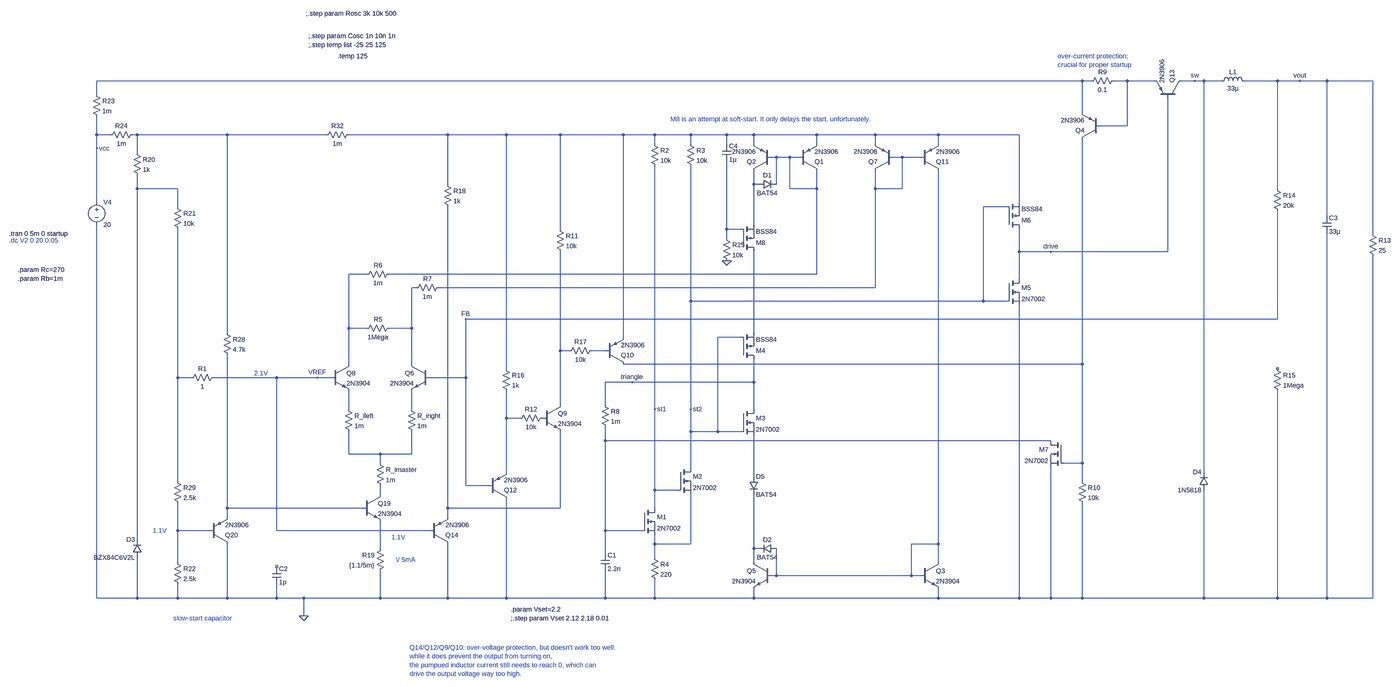
[diagram p0: schematic step_down3.asc, whole sheet]
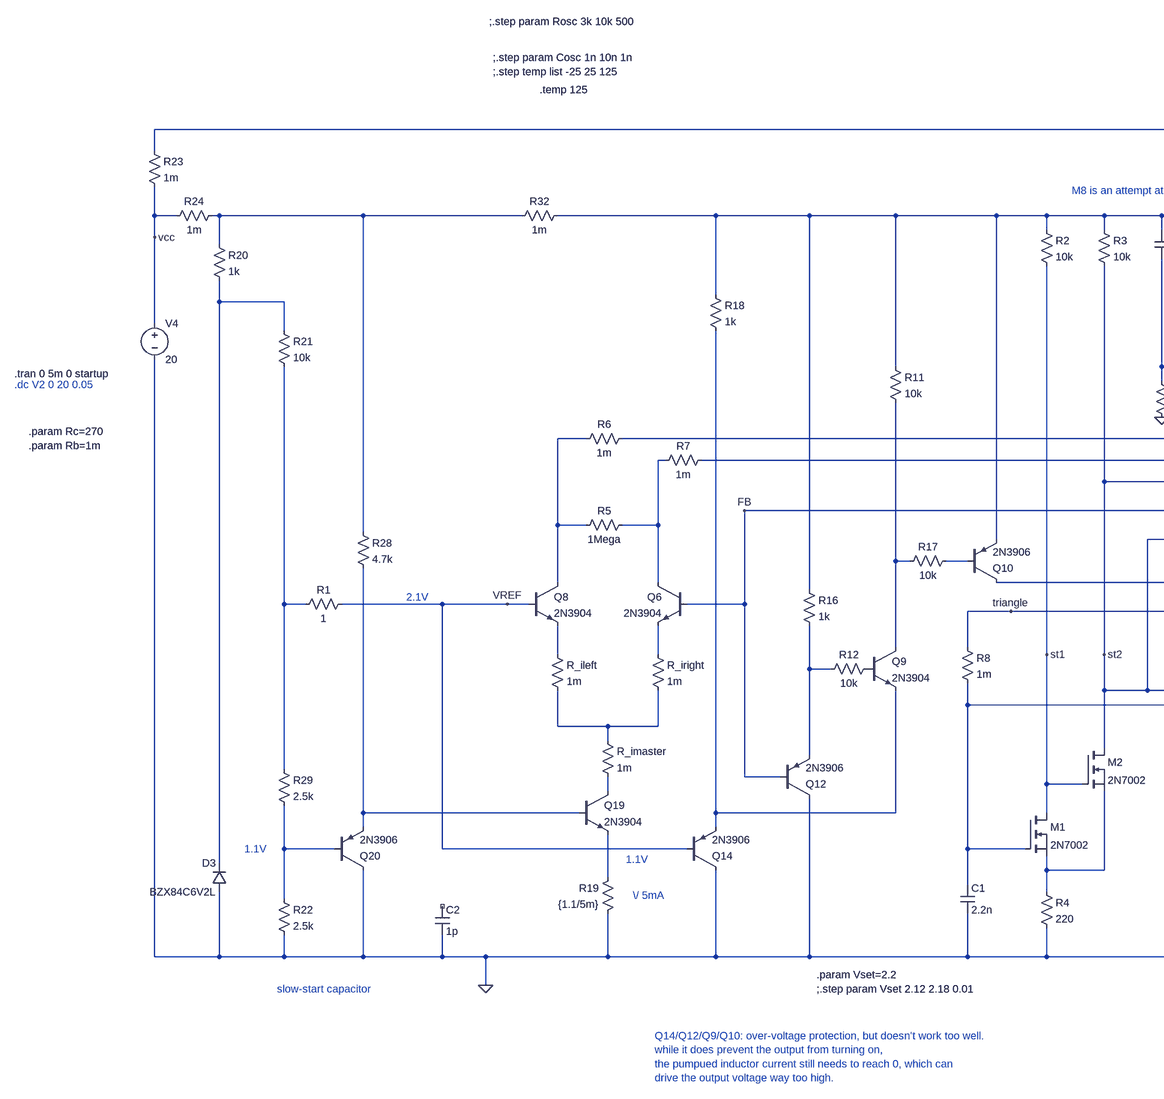
[diagram p1: schematic step_down3.asc, part, row 1 of 1, column 1 of 2]
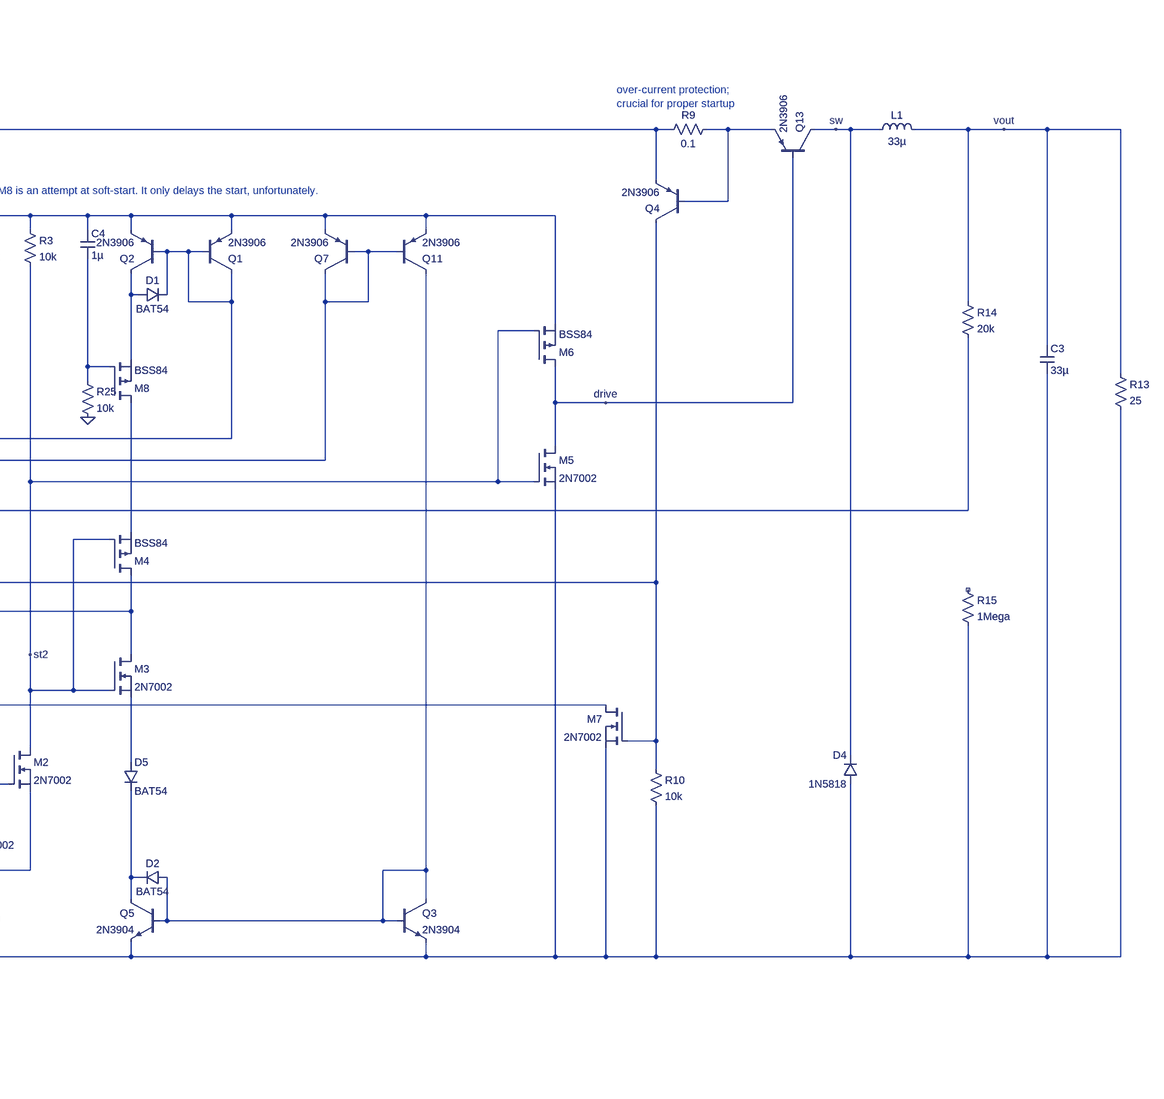
[diagram p2: schematic step_down3.asc, part, row 1 of 1, column 2 of 2]
step_down3.asc, the LTspice schematic file:
Version 4.1
SHEET 1 7684 6532
WIRE 4064 4416 560 4416
WIRE 4096 4416 4064 4416
WIRE 4224 4416 4176 4416
WIRE 4320 4416 4224 4416
WIRE 4464 4416 4416 4416
WIRE 4496 4416 4464 4416
WIRE 4560 4416 4496 4416
WIRE 4816 4416 4640 4416
WIRE 4896 4416 4816 4416
WIRE 4992 4416 4896 4416
WIRE 5184 4416 4992 4416
WIRE 560 4464 560 4416
WIRE 4064 4528 4064 4416
WIRE 4224 4576 4224 4416
WIRE 4224 4576 4128 4576
WIRE 560 4608 560 4544
WIRE 608 4608 560 4608
WIRE 704 4608 688 4608
WIRE 1024 4608 704 4608
WIRE 1376 4608 1024 4608
WIRE 1808 4608 1456 4608
WIRE 2016 4608 1808 4608
WIRE 2208 4608 2016 4608
WIRE 2432 4608 2208 4608
WIRE 2544 4608 2432 4608
WIRE 2672 4608 2544 4608
WIRE 2800 4608 2672 4608
WIRE 2896 4608 2800 4608
WIRE 3120 4608 2896 4608
WIRE 3328 4608 3120 4608
WIRE 3552 4608 3328 4608
WIRE 3840 4608 3552 4608
WIRE 2544 4640 2544 4608
WIRE 2672 4640 2672 4608
WIRE 2800 4640 2800 4608
WIRE 2896 4640 2896 4608
WIRE 3120 4640 3120 4608
WIRE 3328 4640 3328 4608
WIRE 3552 4640 3552 4608
WIRE 560 4656 560 4608
WIRE 704 4672 704 4608
WIRE 2976 4688 2960 4688
WIRE 3024 4688 2976 4688
WIRE 3056 4688 3024 4688
WIRE 3424 4688 3392 4688
WIRE 3488 4688 3424 4688
WIRE 1808 4784 1808 4608
WIRE 2896 4784 2896 4736
WIRE 2912 4784 2896 4784
WIRE 2976 4784 2976 4688
WIRE 704 4800 704 4752
WIRE 848 4800 704 4800
WIRE 3024 4800 3024 4688
WIRE 3120 4800 3120 4736
WIRE 3120 4800 3024 4800
WIRE 3328 4800 3328 4736
WIRE 3424 4800 3424 4688
WIRE 3424 4800 3328 4800
WIRE 4816 4800 4816 4416
WIRE 560 4848 560 4656
WIRE 3840 4848 3840 4608
WIRE 848 4864 848 4800
WIRE 3792 4864 3712 4864
WIRE 4992 4896 4992 4416
WIRE 2896 4928 2896 4784
WIRE 2208 4944 2208 4608
WIRE 2800 4944 2800 4704
WIRE 2848 4944 2800 4944
WIRE 5184 4960 5184 4416
WIRE 2800 4976 2800 4944
WIRE 3840 5024 3840 4944
WIRE 3952 5024 3840 5024
WIRE 4368 5024 4368 4480
WIRE 4368 5024 3952 5024
WIRE 1520 5104 1456 5104
WIRE 3120 5104 3120 4800
WIRE 3120 5104 1600 5104
WIRE 3840 5120 3840 5024
WIRE 1696 5152 1680 5152
WIRE 3328 5152 3328 4800
WIRE 3328 5152 1776 5152
WIRE 2672 5200 2672 4720
WIRE 3712 5200 3712 4864
WIRE 3712 5200 2672 5200
WIRE 3792 5200 3712 5200
WIRE 4816 5264 4816 4880
WIRE 4816 5264 1872 5264
WIRE 1456 5296 1456 5104
WIRE 1520 5296 1456 5296
WIRE 1680 5296 1680 5152
WIRE 1680 5296 1600 5296
WIRE 1024 5312 1024 4608
WIRE 2896 5312 2896 5024
WIRE 2432 5328 2432 4608
WIRE 2848 5328 2768 5328
WIRE 2208 5376 2208 5024
WIRE 2240 5376 2208 5376
WIRE 2368 5376 2320 5376
WIRE 1456 5424 1456 5296
WIRE 1680 5424 1680 5296
WIRE 4064 5424 4064 4624
WIRE 4064 5424 2432 5424
WIRE 2016 5440 2016 4608
WIRE 848 5472 848 4944
WIRE 896 5472 848 5472
WIRE 1200 5472 976 5472
WIRE 1344 5472 1200 5472
WIRE 1392 5472 1344 5472
WIRE 1872 5472 1872 5264
WIRE 1872 5472 1744 5472
WIRE 2464 5488 2368 5488
WIRE 2896 5488 2896 5408
WIRE 2896 5488 2464 5488
WIRE 2208 5568 2208 5376
WIRE 2368 5568 2368 5488
WIRE 1456 5584 1456 5520
WIRE 1680 5584 1680 5520
WIRE 2544 5584 2544 4720
WIRE 2672 5584 2672 5200
WIRE 2896 5584 2896 5488
WIRE 2016 5616 2016 5520
WIRE 2064 5616 2016 5616
WIRE 2672 5664 2672 5584
WIRE 2768 5664 2768 5328
WIRE 2768 5664 2672 5664
WIRE 2848 5664 2768 5664
WIRE 2368 5696 2368 5648
WIRE 3952 5696 2368 5696
WIRE 1456 5744 1456 5664
WIRE 1568 5744 1456 5744
WIRE 1680 5744 1680 5664
WIRE 1680 5744 1568 5744
WIRE 1568 5776 1568 5744
WIRE 4064 5776 4064 5424
WIRE 4064 5776 4000 5776
WIRE 2672 5792 2672 5664
WIRE 2016 5808 2016 5616
WIRE 4496 5808 4496 4416
WIRE 2896 5824 2896 5680
WIRE 848 5840 848 5472
WIRE 4064 5840 4064 5776
WIRE 1872 5856 1872 5472
WIRE 1952 5856 1872 5856
WIRE 2544 5872 2544 5584
WIRE 2624 5872 2544 5872
WIRE 1568 5888 1568 5856
WIRE 1024 5936 1024 5392
WIRE 1504 5936 1024 5936
WIRE 1808 5936 1808 4864
WIRE 2208 5936 2208 5664
WIRE 2208 5936 1808 5936
WIRE 2544 5936 2544 5872
WIRE 1024 5968 1024 5936
WIRE 1808 5968 1808 5936
WIRE 848 6016 848 5920
WIRE 960 6016 848 6016
WIRE 1200 6016 1200 5472
WIRE 1744 6016 1200 6016
WIRE 2368 6016 2368 5696
WIRE 2496 6016 2368 6016
WIRE 704 6048 704 4800
WIRE 2544 6064 2544 6032
WIRE 2672 6064 2672 5888
WIRE 2672 6064 2544 6064
WIRE 3552 6064 3552 4736
WIRE 3552 6064 3456 6064
WIRE 1568 6080 1568 5984
WIRE 2896 6080 2896 5888
WIRE 2912 6080 2896 6080
WIRE 2368 6096 2368 6016
WIRE 2544 6112 2544 6064
WIRE 848 6128 848 6016
WIRE 2896 6128 2896 6080
WIRE 3552 6128 3552 6064
WIRE 2976 6176 2976 6080
WIRE 2976 6176 2960 6176
WIRE 3456 6176 3456 6064
WIRE 3456 6176 2976 6176
WIRE 3488 6176 3456 6176
WIRE 560 6256 560 4928
WIRE 704 6256 704 6112
WIRE 704 6256 560 6256
WIRE 848 6256 848 6208
WIRE 848 6256 704 6256
WIRE 1024 6256 1024 6064
WIRE 1024 6256 848 6256
WIRE 1200 6256 1200 6208
WIRE 1200 6256 1024 6256
WIRE 1296 6256 1200 6256
WIRE 1568 6256 1568 6160
WIRE 1568 6256 1296 6256
WIRE 1808 6256 1808 6064
WIRE 1808 6256 1568 6256
WIRE 2016 6256 2016 5904
WIRE 2016 6256 1808 6256
WIRE 2368 6256 2368 6160
WIRE 2368 6256 2016 6256
WIRE 2544 6256 2544 6192
WIRE 2544 6256 2368 6256
WIRE 2896 6256 2896 6224
WIRE 2896 6256 2544 6256
WIRE 3552 6256 3552 6224
WIRE 3552 6256 2896 6256
WIRE 3840 6256 3840 5216
WIRE 3840 6256 3552 6256
WIRE 3952 6256 3952 5792
WIRE 3952 6256 3840 6256
WIRE 4064 6256 4064 5920
WIRE 4064 6256 3952 6256
WIRE 4496 6256 4496 5872
WIRE 4496 6256 4064 6256
WIRE 4816 6256 4816 5520
WIRE 4816 6256 4496 6256
WIRE 4992 6256 4992 4960
WIRE 4992 6256 4816 6256
WIRE 5184 6256 5184 5040
WIRE 5184 6256 4992 6256
WIRE 1296 6320 1296 6256
FLAG 1296 6320 0
FLAG 1344 5472 VREF
FLAG 1872 5264 FB
FLAG 2464 5488 triangle
FLAG 3952 5024 drive
FLAG 4464 4416 sw
FLAG 2544 5584 st1
FLAG 2672 5584 st2
FLAG 4896 4416 vout
FLAG 560 4656 vcc
FLAG 2800 5056 0
SYMBOL voltage 560 4832 R0
SYMATTR InstName V4
SYMATTR Value 20
SYMBOL res 1584 6064 M0
SYMATTR InstName R19
SYMATTR Value {1.1/5m}
SYMBOL npn 1744 5424 M0
SYMATTR InstName Q6
SYMATTR Value 2N3904
SYMBOL npn 1392 5424 R0
SYMATTR InstName Q8
SYMATTR Value 2N3904
SYMBOL diode 720 6112 R180
WINDOW 0 24 64 Left 2
WINDOW 3 24 0 Left 2
SYMATTR InstName D3
SYMATTR Value BZX84C6V2L
SYMBOL res 688 4656 R0
SYMATTR InstName R20
SYMATTR Value 1k
SYMBOL res 832 4848 R0
SYMATTR InstName R21
SYMATTR Value 10k
SYMBOL res 832 6112 R0
SYMATTR InstName R22
SYMATTR Value 2.5k
SYMBOL res 544 4448 R0
SYMATTR InstName R23
SYMATTR Value 1m
SYMBOL res 592 4624 R270
WINDOW 0 32 56 VTop 2
WINDOW 3 0 56 VBottom 2
SYMATTR InstName R24
SYMATTR Value 1m
SYMBOL res 1552 5760 R0
SYMATTR InstName R_imaster
SYMATTR Value 1m
SYMBOL npn 1504 5888 R0
SYMATTR InstName Q19
SYMATTR Value 2N3904
SYMBOL res 1008 5296 R0
SYMATTR InstName R28
SYMATTR Value 4.7k
SYMBOL pnp 960 6064 M180
SYMATTR InstName Q20
SYMATTR Value 2N3906
SYMBOL res 832 5824 R0
SYMATTR InstName R29
SYMATTR Value 2.5k
SYMBOL res 1360 4624 R270
WINDOW 0 32 56 VTop 2
WINDOW 3 0 56 VBottom 2
SYMATTR InstName R32
SYMATTR Value 1m
SYMBOL pnp 4416 4480 M270
SYMATTR InstName Q13
SYMATTR Value 2N3906
SYMBOL cap 4976 4896 R0
SYMATTR InstName C3
SYMATTR Value 33µ
SYMBOL res 5168 4944 R0
SYMATTR InstName R13
SYMATTR Value 25
SYMBOL res 4800 4784 R0
SYMATTR InstName R14
SYMATTR Value 20k
SYMBOL res 4800 5424 R0
SYMATTR InstName R15
SYMATTR Value 1Mega
SYMBOL ind 4544 4432 R270
WINDOW 0 32 56 VTop 2
WINDOW 3 5 56 VBottom 2
SYMATTR InstName L1
SYMATTR Value 33µ
SYMATTR SpiceLine Rser=1m
SYMBOL nmos 2496 5936 R0
SYMATTR InstName M1
SYMATTR Value 2N7002
SYMBOL nmos 2624 5792 R0
SYMATTR InstName M2
SYMATTR Value 2N7002
SYMBOL res 2528 4624 R0
SYMATTR InstName R2
SYMATTR Value 10k
SYMBOL res 2656 4624 R0
SYMATTR InstName R3
SYMATTR Value 10k
SYMBOL res 2528 6096 R0
SYMATTR InstName R4
SYMATTR Value 220
SYMBOL nmos 2848 5584 R0
SYMATTR InstName M3
SYMATTR Value 2N7002
SYMBOL cap 2352 6096 R0
SYMATTR InstName C1
SYMATTR Value 2.2n
SYMBOL pmos 2848 5408 M180
SYMATTR InstName M4
SYMATTR Value BSS84
SYMBOL pnp 3056 4736 M180
SYMATTR InstName Q1
SYMATTR Value 2N3906
SYMBOL pnp 2960 4736 R180
SYMATTR InstName Q2
SYMATTR Value 2N3906
SYMBOL diode 2912 4800 R270
WINDOW 0 32 32 VTop 2
WINDOW 3 0 32 VBottom 2
SYMATTR InstName D1
SYMATTR Value BAT54
SYMBOL diode 2976 6096 M270
WINDOW 0 32 32 VTop 2
WINDOW 3 0 32 VBottom 2
SYMATTR InstName D2
SYMATTR Value BAT54
SYMBOL npn 3488 6128 R0
SYMATTR InstName Q3
SYMATTR Value 2N3904
SYMBOL npn 2960 6128 M0
SYMATTR InstName Q5
SYMATTR Value 2N3904
SYMBOL pnp 3392 4736 R180
SYMATTR InstName Q7
SYMATTR Value 2N3906
SYMBOL pnp 3488 4736 M180
SYMATTR InstName Q11
SYMATTR Value 2N3906
SYMBOL nmos 3792 5120 R0
SYMATTR InstName M5
SYMATTR Value 2N7002
SYMBOL pmos 3792 4944 M180
SYMATTR InstName M6
SYMATTR Value BSS84
SYMBOL diode 4512 5872 R180
WINDOW 0 24 64 Left 2
WINDOW 3 24 0 Left 2
SYMATTR InstName D4
SYMATTR Value 1N5818
SYMBOL cap 1184 6144 R0
SYMATTR InstName C2
SYMATTR Value 1p
SYMBOL res 1440 5568 R0
SYMATTR InstName R_ileft
SYMATTR Value 1m
SYMBOL res 1664 5568 R0
SYMATTR InstName R_iright
SYMATTR Value 1m
SYMBOL res 992 5456 R90
WINDOW 0 0 56 VBottom 2
WINDOW 3 32 56 VTop 2
SYMATTR InstName R1
SYMATTR Value 1
SYMBOL res 1616 5280 R90
WINDOW 0 0 56 VBottom 2
WINDOW 3 32 56 VTop 2
SYMATTR InstName R5
SYMATTR Value 1Mega
SYMBOL res 1616 5088 R90
WINDOW 0 0 56 VBottom 2
WINDOW 3 32 56 VTop 2
SYMATTR InstName R6
SYMATTR Value 1m
SYMBOL res 1792 5136 R90
WINDOW 0 0 56 VBottom 2
WINDOW 3 32 56 VTop 2
SYMATTR InstName R7
SYMATTR Value 1m
SYMBOL res 2352 5552 R0
SYMATTR InstName R8
SYMATTR Value 1m
SYMBOL res 4080 4432 R270
WINDOW 0 32 56 VTop 2
WINDOW 3 0 56 VBottom 2
SYMATTR InstName R9
SYMATTR Value 0.1
SYMBOL pnp 4128 4624 R180
SYMATTR InstName Q4
SYMATTR Value 2N3906
SYMBOL res 4048 5824 R0
SYMATTR InstName R10
SYMATTR Value 10k
SYMBOL nmos 4000 5696 M0
SYMATTR InstName M7
SYMATTR Value 2N7002
SYMBOL npn 2144 5568 R0
SYMATTR InstName Q9
SYMATTR Value 2N3904
SYMBOL res 2192 4928 R0
SYMATTR InstName R11
SYMATTR Value 10k
SYMBOL pnp 2368 5424 M180
SYMATTR InstName Q10
SYMATTR Value 2N3906
SYMBOL res 2160 5600 R90
WINDOW 0 0 56 VBottom 2
WINDOW 3 32 56 VTop 2
SYMATTR InstName R12
SYMATTR Value 10k
SYMBOL res 2000 5424 R0
SYMATTR InstName R16
SYMATTR Value 1k
SYMBOL pnp 1952 5904 M180
SYMATTR InstName Q12
SYMATTR Value 2N3906
SYMBOL res 2336 5360 R90
WINDOW 0 0 56 VBottom 2
WINDOW 3 32 56 VTop 2
SYMATTR InstName R17
SYMATTR Value 10k
SYMBOL pnp 1744 6064 M180
SYMATTR InstName Q14
SYMATTR Value 2N3906
SYMBOL res 1792 4768 R0
SYMATTR InstName R18
SYMATTR Value 1k
SYMBOL pmos 2848 5024 M180
SYMATTR InstName M8
SYMATTR Value BSS84
SYMBOL cap 2784 4640 R0
SYMATTR InstName C4
SYMATTR Value 1µ
SYMBOL res 2784 4960 R0
SYMATTR InstName R25
SYMATTR Value 10k
SYMBOL diode 2880 5824 R0
SYMATTR InstName D5
SYMATTR Value BAT54
SYMATTR Description Diode
SYMATTR Type diode
TEXT 248 4960 Left 2 !.tran 0 5m 0 startup
TEXT 280 5088 Left 2 !.param Rc=270
TEXT 280 5120 Left 2 !.param Rb=1m
TEXT 1304 4176 Left 2 !;.step param Rosc 3k 10k 500
TEXT 1312 4256 Left 2 !;.step param Cosc 1n 10n 1n
TEXT 1312 4288 Left 2 !;.step temp list -25 25 125
TEXT 1416 4328 Left 2 !.temp 125
TEXT 248 4984 Left 2 ;.dc V2 0 20 0.05
TEXT 760 6016 Left 2 ;1.1V
TEXT 1608 6040 Left 2 ;1.1V
TEXT 1624 6120 Left 2 ;\\/ 5mA
TEXT 1120 5456 Left 2 ;2.1V
TEXT 2032 6328 Left 2 !;.step param Vset 2.12 2.18 0.01
TEXT 2032 6296 Left 2 !.param Vset=2.2
TEXT 832 6328 Left 2 ;slow-start capacitor
TEXT 3976 4328 Left 2 ;over-current protection;\ncrucial for proper startup
TEXT 1672 6432 Left 2 ;Q14/Q12/Q9/Q10: over-voltage protection, but doesn't work too well.\nwhile it does prevent the output from turning on,\nthe pumpued inductor current still needs to reach 0, which can\ndrive the output voltage way too high.
TEXT 2600 4552 Left 2 ;M8 is an attempt at soft-start. It only delays the start, unfortunately.

The netlist it stands for:
* step_down3.asc
V4 vcc 0 20
R19 N029 0 {1.1/5m}
Q6 N011 FB N018 0 2N3904
Q8 N010 VREF N017 0 2N3904
D3 0 N008 BZX84C6V2L
R20 N003 N008 1k
R21 N008 N016 10k
R22 N026 0 2.5k
R23 N001 vcc 1m
R24 vcc N003 1m
R_imaster N021 N023 1m
Q19 N023 N024 N029 0 2N3904
R28 N003 N024 4.7k
Q20 0 N026 N024 0 2N3906
R29 N016 N026 2.5k
R32 N003 N004 1m
Q13 sw drive N002 0 2N3906
C3 vout 0 33µ
R13 vout 0 25
R14 vout FB 20k
R15 NC_01 0 1Mega
L1 sw vout 33µ Rser=1m
M1 st1 N020 N027 N027 2N7002
M2 st2 st1 N027 N027 2N7002
R2 N004 st1 10k
R3 N004 st2 10k
R4 N027 0 220
M3 triangle st2 N022 N022 2N7002
C1 N020 0 2.2n
M4 triangle st2 N012 N012 BSS84
Q1 N005 N005 N004 0 2N3906
Q2 N007 N005 N004 0 2N3906
D1 N007 N005 BAT54
D2 N028 N030 BAT54
Q3 N028 N028 0 0 2N3904
Q5 N030 N028 0 0 2N3904
Q7 N006 N006 N004 0 2N3906
Q11 N028 N006 N004 0 2N3906
M5 drive st2 0 0 2N7002
M6 drive st2 N004 N004 BSS84
D4 0 sw 1N5818
C2 NC_02 0 1p
R_ileft N017 N021 1m
R_iright N018 N021 1m
R1 VREF N016 1
R5 N011 N010 1Mega
R6 N005 N010 1m
R7 N006 N011 1m
R8 triangle N020 1m
R9 N001 N002 0.1
Q4 N015 N002 N001 0 2N3906
R10 N015 0 10k
M7 N020 N015 0 0 2N7002
Q9 N013 P001 N025 0 2N3904
R11 N004 N013 10k
Q10 N015 N014 N004 0 2N3906
R12 P001 N019 10k
R16 N004 N019 1k
Q12 0 FB N019 0 2N3906
R17 N014 N013 10k
Q14 0 VREF N025 0 2N3906
R18 N004 N025 1k
M8 N012 N009 N007 N007 BSS84
C4 N004 N009 1µ
R25 N009 0 10k
D5 N022 N030 BAT54
.model D D
.lib standard.dio
.model NPN NPN
.model PNP PNP
.lib standard.bjt
.model NMOS NMOS
.model PMOS PMOS
.lib standard.mos
.tran 0 5m 0 startup
.param Rc=270
.param Rb=1m
;.step param Rosc 3k 10k 500
;.step param Cosc 1n 10n 1n
;.step temp list -25 25 125
.temp 125
* .dc V2 0 20 0.05
* 1.1V
* 1.1V
* \/ 5mA
* 2.1V
;.step param Vset 2.12 2.18 0.01
.param Vset=2.2
* slow-start capacitor
* over-current protection;
* crucial for proper startup
* Q14/Q12/Q9/Q10: over-voltage protection, but doesn't work too well.
* while it does prevent the output from turning on,
* the pumpued inductor current still needs to reach 0, which can
* drive the output voltage way too high.
* M8 is an attempt at soft-start. It only delays the start, unfortunately.
.backanno
.end